# EAGLE design Hbridge (EAGLE 9.6.0)
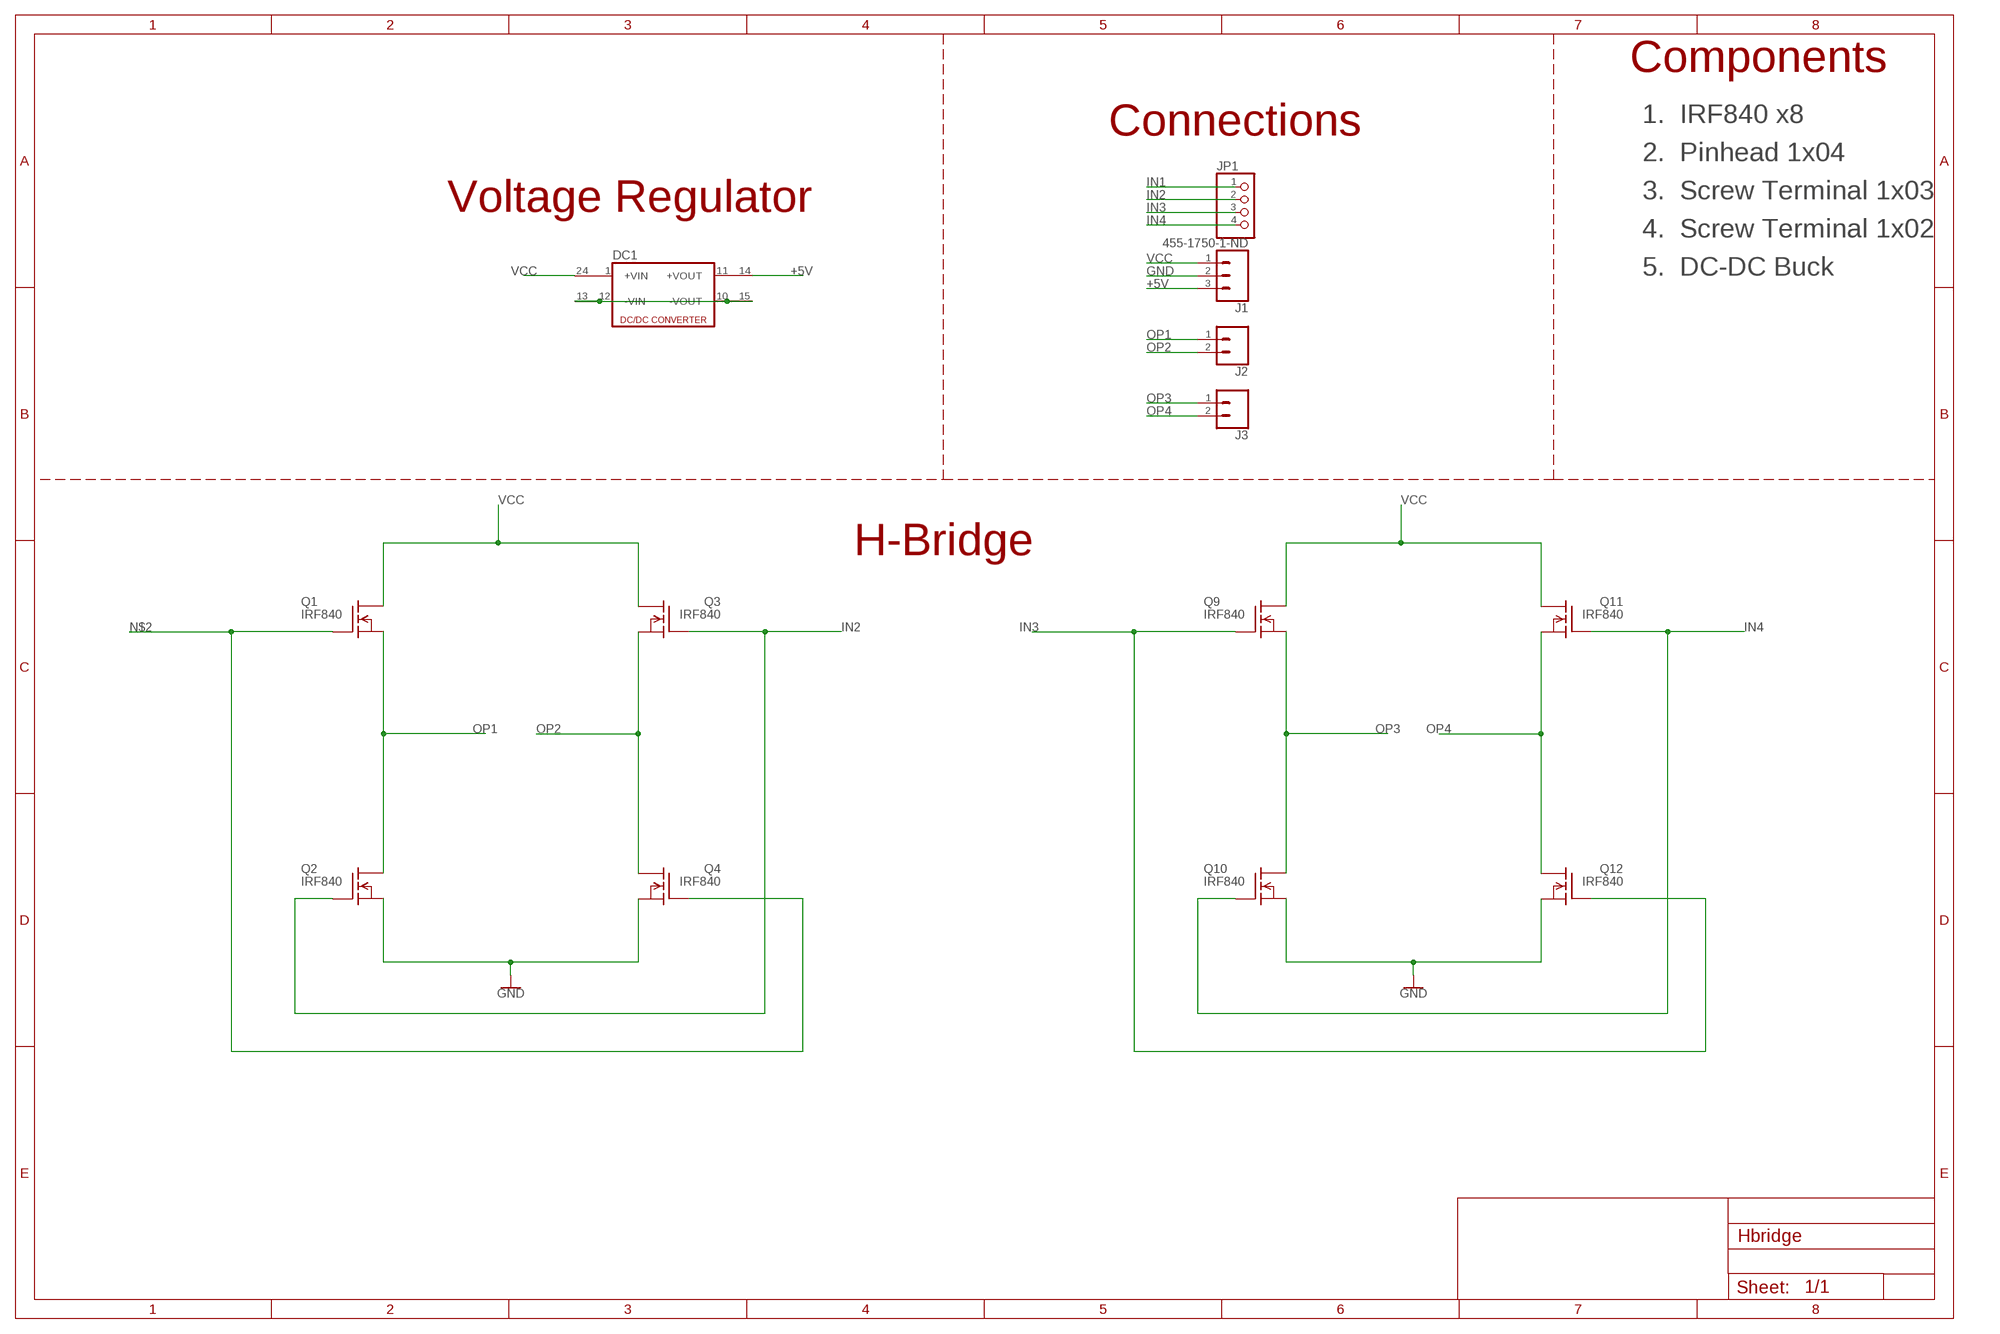
[diagram p0: schematic, sheet 1]

## Parts
DC1  DC213R  [CMK]
J1  455-1750-1-ND  CONN_03  [1X03]
J2  CONN_02  [1X02]
J3  CONN_02  [1X02]
JP1  PINHD-1X4  [1X04]
Q1  IRF840  [TO220]
Q2  IRF840  [TO220]
Q3  IRF840  [TO220]
Q4  IRF840  [TO220]
Q9  IRF840  [TO220]
Q10  IRF840  [TO220]
Q11  IRF840  [TO220]
Q12  IRF840  [TO220]

## Nets
+5V: DC1.14(+VOUT1) J1.3
GND: J1.2 Q2.3(S) Q4.3(S) Q10.3(S) Q12.3(S)
IN1: JP1.1
IN2: JP1.2 Q2.1(G) Q3.1(G)
IN3: JP1.3 Q9.1(G) Q12.1(G)
IN4: JP1.4 Q10.1(G) Q11.1(G)
N$2: Q1.1(G) Q4.1(G)
N$22: DC1.10(-VOUT) DC1.12(-VIN) DC1.13(-VIN1) DC1.15(-VOUT1)
OP1: J2.1 Q1.3(S) Q2.2(D)
OP2: J2.2 Q3.3(S) Q4.2(D)
OP3: J3.1 Q9.3(S) Q10.2(D)
OP4: J3.2 Q11.3(S) Q12.2(D)
VCC: DC1.24(+VIN1) J1.1 Q1.2(D) Q3.2(D) Q9.2(D) Q11.2(D)
Unconnected: DC1.1(+VIN) DC1.11(+VOUT)

## Notes on the sheet
- Components
- 1.  IRF840 x8
- Connections
- 2.  Pinhead 1x04
- 3.  Screw Terminal 1x03
- Voltage Regulator
- 4.  Screw Terminal 1x02
- 5.  DC-DC Buck
- H-Bridge

## Library data of the parts
DC1 = dc-dc-converter:DC213R: DC-DC CONVERTER; OC_FARNELL: unknown; OC_NEWARK: unknown
J1 = SparkFun-Connectors:CONN_03: Multi connection point. Often used as Generic Header-pin footprint for 0.1 inch spaced/style header connections On any of the 0.1 inch spaced packages, you can populate with these: Break Away Headers - Straight <https://www.sparkfun.com/products/116> (PRT-00116) Break Away Male Headers - Right Angle <https://www.sparkfun.com/products/553> (PRT-00553) Female Headers <https://www.sparkfun.com/products/115> (PRT-00115) Break Away Headers - Machine Pin <https://www.sparkfun.com/products/117> (PRT-00117) Break Away Female Headers - Swiss Machine Pin <https://www.sparkfun.com/products/743> (PRT-00743) Stackable Header - 3 Pin (Female, 0.1") <https://www.sparkfun.com/products/13875> (PRT-13875) For SCREWTERMINALS and SPRING TERMINALS visit here: Screw Terimnals on SparkFun.com <https://www.sparkfun.com/search/results?term=Screw+Terminals> (5mm/3.5mm/2.54mm spacing) This device is also useful as a general connection point to wire up your design to another part of your project. Our various solder wires solder well into these plated through hole pads. Hook-Up Wire - Assortment (Stranded, 22 AWG) <https://www.sparkfun.com/products/11375> (PRT-11375) Hook-Up Wire - Assortment (Solid Core, 22 AWG) <https://www.sparkfun.com/products/11367> (PRT-11367) View the entire wire category on our website here <https://www.sparkfun.com/categories/141> Special notes: Molex polarized connector foot print use with SKU : PRT-08232 with associated crimp pins and housings.; PROD_ID: XXX-00000
J2 J3 = SparkFun-Connectors:CONN_02: Multi connection point. Often used as Generic Header-pin footprint for 0.1 inch spaced/style header connections On any of the 0.1 inch spaced packages, you can populate with these: Break Away Headers - Straight <https://www.sparkfun.com/products/116> (PRT-00116) Break Away Male Headers - Right Angle <https://www.sparkfun.com/products/553> (PRT-00553) Female Headers <https://www.sparkfun.com/products/115> (PRT-00115) Break Away Headers - Machine Pin <https://www.sparkfun.com/products/117> (PRT-00117) Break Away Female Headers - Swiss Machine Pin <https://www.sparkfun.com/products/743> (PRT-00743) For SCREWTERMINALS and SPRING TERMINALS visit here: Screw Terimnals on SparkFun.com <https://www.sparkfun.com/search/results?term=Screw+Terminals> (5mm/3.5mm/2.54mm spacing) This device is also useful as a general connection point to wire up your design to another part of your project. Our various solder wires solder well into these plated through hole pads. Hook-Up Wire - Assortment (Stranded, 22 AWG) <https://www.sparkfun.com/products/11375> (PRT-11375) Hook-Up Wire - Assortment (Solid Core, 22 AWG) <https://www.sparkfun.com/products/11367> (PRT-11367) View the entire wire category on our website here <https://www.sparkfun.com/categories/141> Special notes: Molex polarized connector foot print use with: PRT-08233 with associated crimp pins and housings. 2.54_SCREWTERM for use with PRT-10571. 3.5mm Screw Terminal footprints for PRT-08084 5mm Screw Terminal footprints for use with PRT-08432
JP1 = pinhead:PINHD-1X4: PIN HEADER
Q1-Q4 Q9-Q12 = transistor-fet:IRF840: N-Channel Enhancement MOSFET (HEXFET); 500V; 8A; 0,85Ohm

## Board
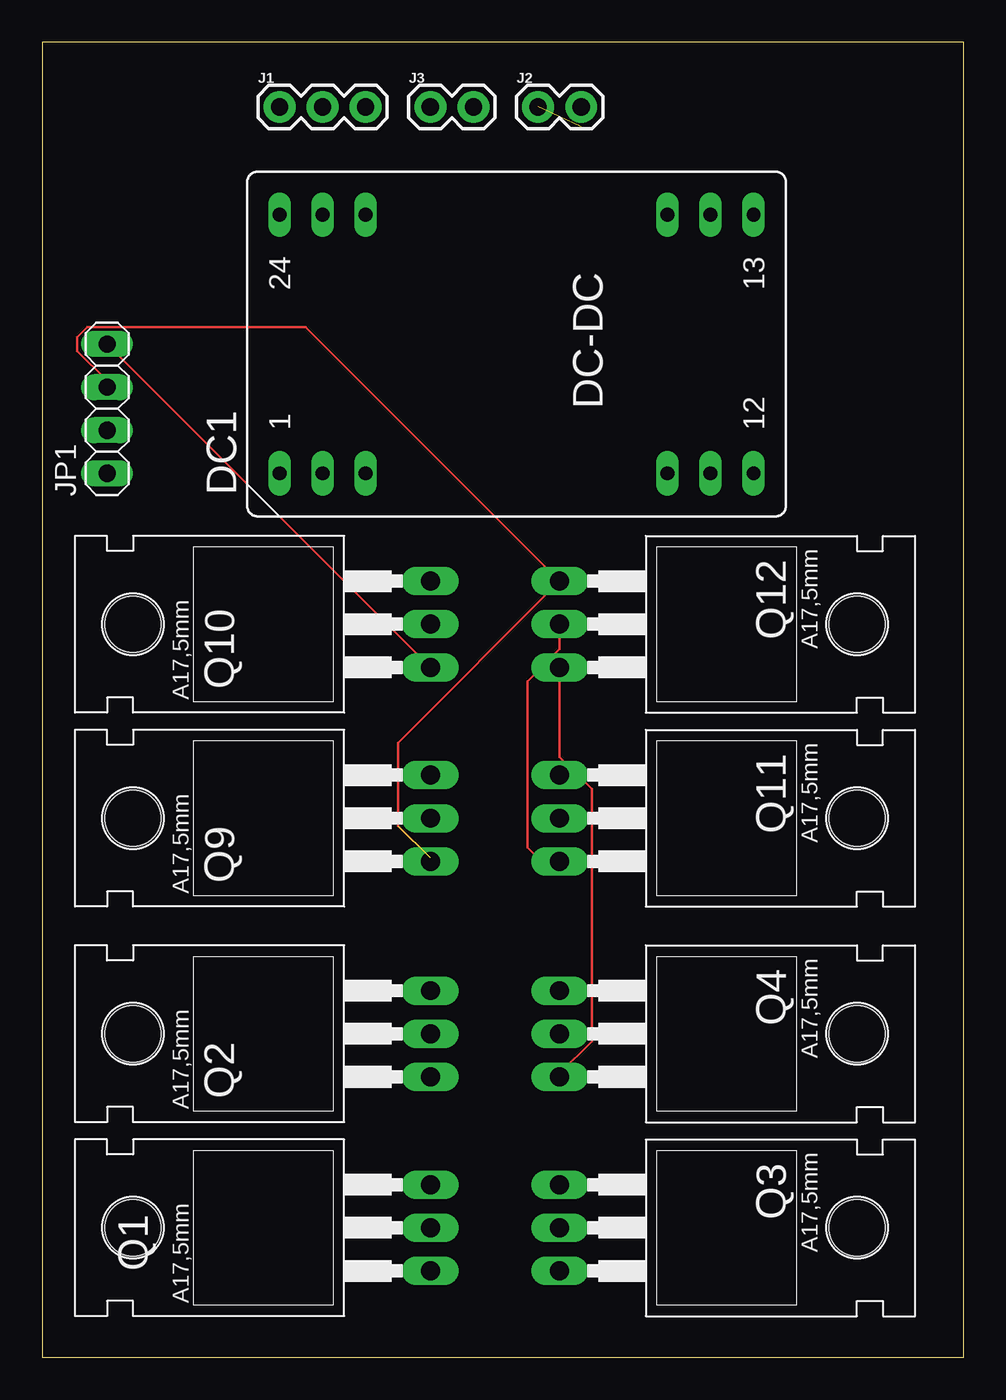
[diagram p1: board, top side]
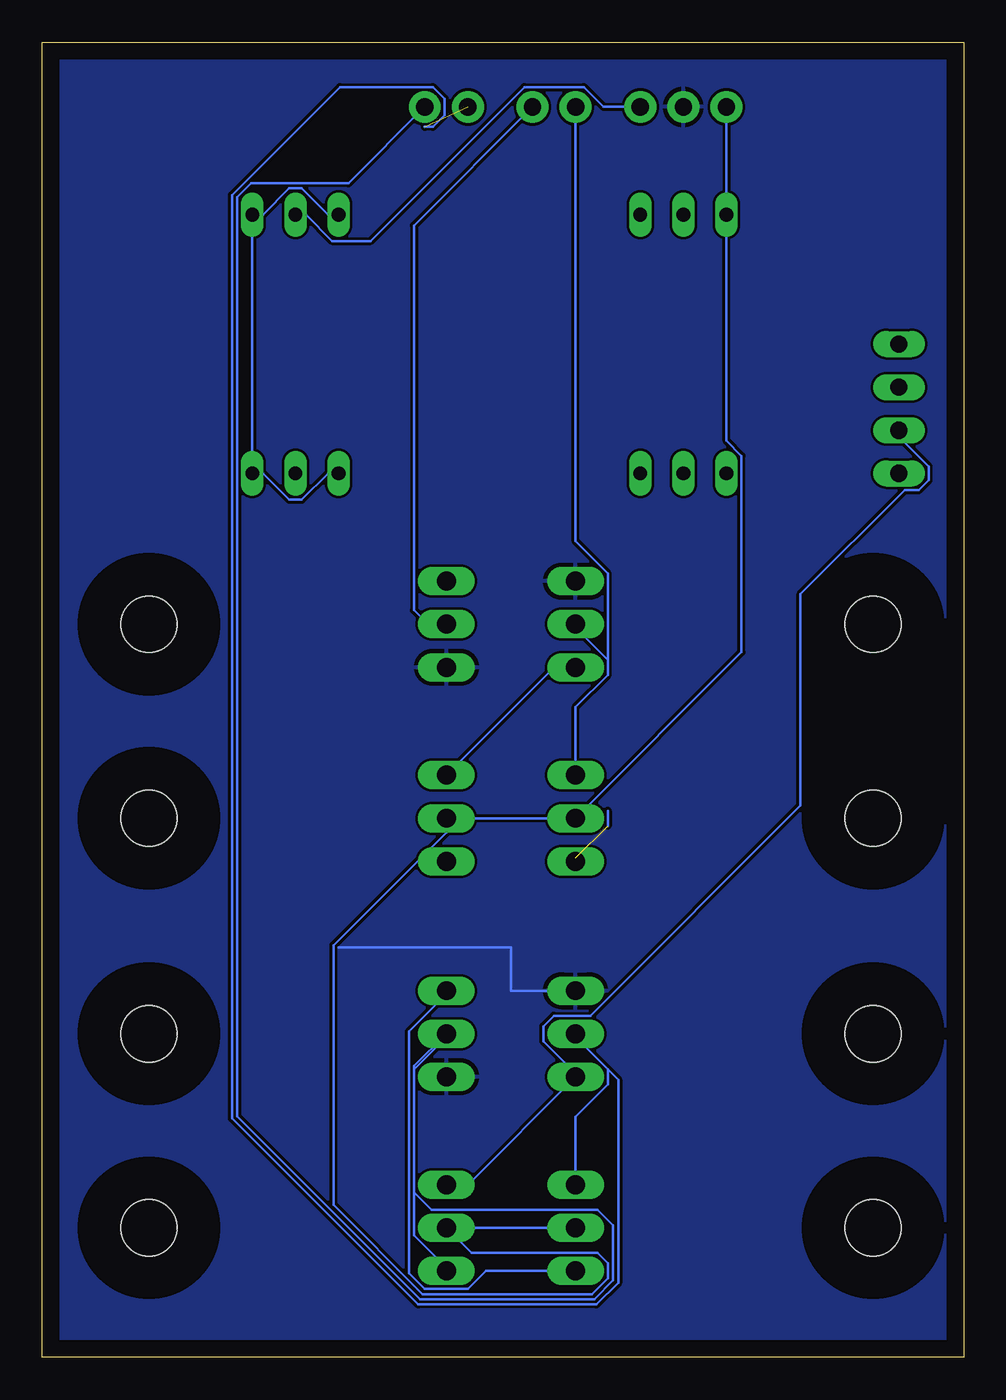
[diagram p2: board, bottom side, seen from below]

Size 54.28 x 77.46 mm. Coordinates in mm from the lower left corner, seen from the top.
Outline: 0,0 54.28,0 54.28,77.46 0,77.46 0,0
Copper layers (1*16): Top 0.035mm / dielectric 1.5mm / Bottom 0.035mm
Design rules "default": minimum track width 6mil, minimum drill 0.35mm, track to track 6mil, track to pad 6mil, pad to pad 6mil, via to via 6mil, smd to smd 6mil, copper to edge 40mil, drill to drill 6mil, minimum pad ring 10mil, minimum via ring 8mil, stop-mask expansion 4mil, vias tented up to drill 0mil, thermal gap 10mil

### Footprints (pad centres in the part's own frame; a part is rotated, then mirrored left to right if it is on the bottom)
CMK = drill 0.813 long: 1 -7.62,13.97; 2 -7.62,11.43; 3 -7.62,8.89; 10 -7.62,-8.89; 11 -7.62,-11.43; 12 -7.62,-13.97; 13 7.62,-13.97; 14 7.62,-11.43; 15 7.62,-8.89; 22 7.62,8.89; 23 7.62,11.43; 24 7.62,13.97
1X03 = drill 1.016 pad 1.88: 1 0,0; 2 2.54,0; 3 5.08,0
1X02 = drill 1.016 pad 1.88: 1 0,0; 2 2.54,0
1X04 = drill 1.016 long: 1 -3.81,0; 2 -1.27,0; 3 1.27,0; 4 3.81,0
TO220 = drill 1.118 long: 1 -2.54,-6.35; 2 0,-6.35; 3 2.54,-6.35 | hole 3.302: 0,11.176

### Placement (x,y rotation side)
DC1  27.94,59.69 90 top
J1  13.97,73.66 0 top
J2  29.21,73.66 0 top
J3  22.86,73.66 0 top
JP1  3.81,55.88 90 top
Q1  16.51,7.62 90 top
Q2  16.51,19.05 90 top
Q3  36.83,7.62 270 top
Q4  36.83,19.05 270 top
Q9  16.51,31.75 90 top
Q10  16.51,43.18 90 top
Q11  36.83,31.75 270 top
Q12  36.83,43.18 270 top

### Tracks (layer width: path | path; a pad name or v marks a point on that pad's centre or on a via)
+5V
  Bottom 0.152: J1.3 21.21,73.66 22.38,74.83 25.88,74.83 34.95,65.76 37.2,65.76 38.75,67.31 DC1.14
GND
  Top 0.152: Q12.3 30.48,35.37 32.38,33.46 32.38,18.61 30.48,16.7 Q4.3
  Bottom 0.152: Q2.3 26.67,21.59 26.67,24.13 36.83,24.13
  pour Bottom: 0,0 54.61,0 54.61,77.47 0,77.47
IN2
  Bottom 0.152: Q3.1 29.21,10.16 Q2.1 22.86,16.7 24.77,18.61 24.77,19.49 24.14,20.12 21.99,20.12 9.6,32.5 9.6,44.95 3.47,51.08 2.64,51.08 2.06,51.66 2.06,52.48 3.81,54.23 JP1.2
IN3  (1 unrouted)
  Top 0.152: Q9.1 22.86,29.4 20.95,31.31 20.95,36.2 Q12.1 15.52,60.68 2.64,60.68 2.06,60.1 2.06,59.28 3.81,57.53 JP1.3
  Bottom 0.152: 20.95,32.19 20.95,31.31 | 22.86,29.4 Q9.1
IN4
  Top 0.152: JP1.4 Q10.1
  Bottom 0.152: Q11.1 24.13,40.64 Q10.1
N$2
  Bottom 0.152: Q4.1 30.48,21.4 32.69,19.19 32.69,4.94 31.76,4.01 29.2,4.01 28.13,5.08 Q1.1
N$22
  Bottom 0.152: DC1.10 37.45,52.07 39,50.52 39.74,50.52 41.29,52.07 DC1.12 DC1.13 41.29,67.31 39.74,68.86 39,68.86 37.45,67.31 DC1.15
OP1  (1 unrouted)
  Bottom 0.152: 20.95,16.95 20.95,16.07 22.86,14.16 Q1.3 | 31.75,72.49 31.27,72.49 30.58,73.18 30.58,74.14 31.27,74.83 36.74,74.83 43.1,68.47 43.1,14.06 32.14,3.1 21.63,3.1 20.34,4.39 20.34,16.34 20.95,16.95 | Q2.2 22.86,18.86 20.95,16.95
OP2
  Bottom 0.152: Q3.3 30.48,5.27 32.38,7.18 32.38,9.72 | 32.38,9.72 32.38,16.95 | 32.38,16.95 30.48,18.86 Q4.2 32.38,17.14 32.38,16.95 | 32.38,9.72 31.35,8.69 21.58,8.69 20.65,7.76 20.65,4.51 21.76,3.4 32.01,3.4 42.8,14.19 42.8,68.34 41.97,69.16 36.25,69.16 J2.2
OP3
  Bottom 0.152: 22.86,43.37 Q10.2 22.86,42.99 20.95,41.08 | 20.95,41.08 20.95,40.2 22.86,38.29 Q9.3 | J3.1 22.86,48.07 20.95,46.16 20.95,41.08
OP4
  Top 0.152: Q11.3 29.4,29.21 28.57,30.04 28.57,39.81 30.48,41.72 Q12.2
  Bottom 0.152: Q12.2 31.56,43.18 32.38,44.01 32.38,66.67 J3.2
VCC
  Bottom 0.152: Q1.2 Q3.2 29.01,6.15 21.58,6.15 20.95,5.52 20.95,4.64 21.89,3.71 31.89,3.71 37.13,8.96 37.13,24.26 30.48,30.91 Q11.2 Q9.2 | J1.1 DC1.24 13.97,53.99 13.08,53.1 13.08,41.53 Q9.2 | 22.86,31.56 Q9.2